# Altium project Ground Station.PrjPcb
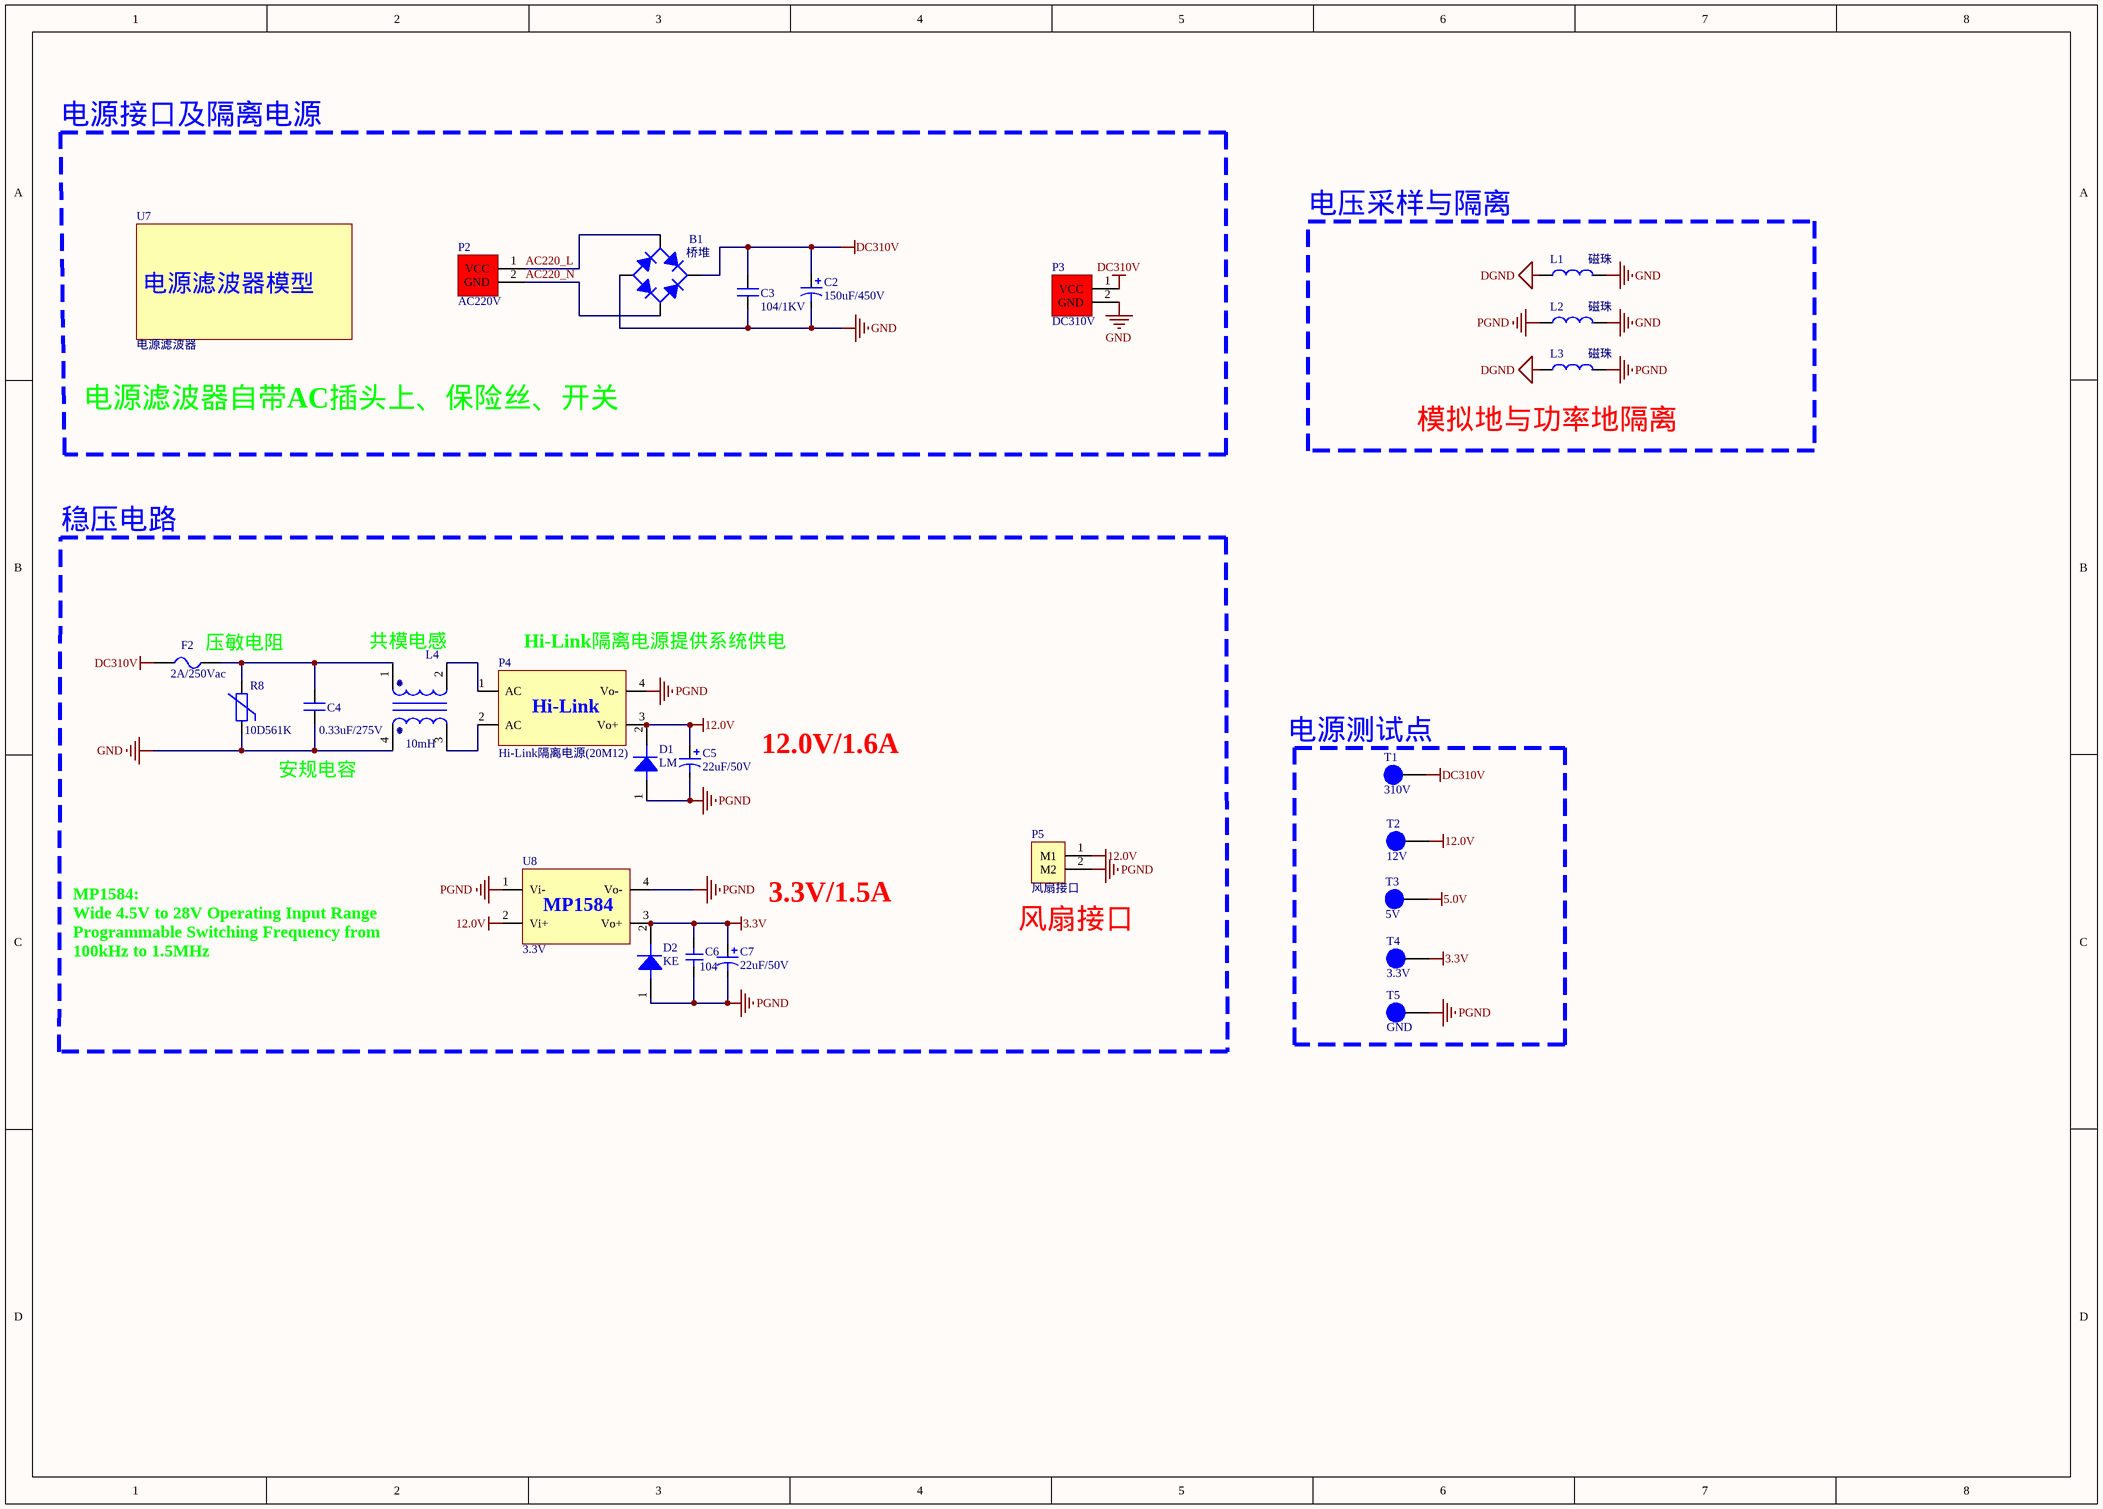
[diagram p0: power.SchDoc]
2 sheets, 50 parts. Net scope: global (net labels, ports and power ports of the same name join across sheets).
Board file: Ground_Station_V1.0.PcbDoc
Sheets:
  power.SchDoc
  device.SchDoc

## Sheet power.SchDoc
size A3

### Parts
B1  桥堆  [KBPC1010]
C2  150uF/450V  [CAP 7.5*18*35.5-H - BK]
C3  104/1KV  [CY 5*7*2.5]
C4  0.33uF/275V  [安规电容 x2v-18w15h5-9t5-p15]
C5  22uF/50V  [CM D(6.3*5.4)]
C6  104  [0805C]
C7  22uF/50V  [CM D(6.3*5.4)]
D1  LM  [SMA]
D2  KE  [SMA]
F2  2A/250Vac  [FU 5x20]
L1  磁珠  [1206L]
L2  磁珠  [1206L]
L3  磁珠  [1206L]
L4  10mH  [T12x6x4]
P2  AC220V  [XT30-F]
P3  DC310V  [XT30-F]
P4  Hi-Link隔离电源(20M12)  [HLK-20M24]
P5  风扇接口  [XH2/2.54mm/180]
R8  10D561K  [VDR 10D-4.5]
T1  310V  [HEADER 1]
T2  12V  [HEADER 1]
T3  5V  [HEADER 1]
T4  3.3V  [HEADER 1]
T5  GND  [HEADER 1]
U7  电源滤波器  [电源滤波器绿灯开关双保险]
U8  3.3V  [MP1584电源模块]

### Nets
3.3V: C6.2 C7.1 D2.2 T4.1 U8.3(Vo+)
5.0V: T3.1
12.0V: C5.1 D1.2 P4.3(Vo+) P5.1(M1) T2.1 U8.2(Vi+)
DC310V: B1.DC+ C2.1 C3.2 F2.1 P3.1(VCC) T1.1
DGND: L1.1 L3.1
GND: B1.DC- C2.2 C3.1 C4.1 L1.2 L2.2 L4.4 P3.2(GND) R8.1
PGND: C5.2 C6.1 C7.2 D1.1 D2.1 L2.1 L3.2 P4.4(Vo-) P5.2(M2) T5.1 U8.1(Vi-) U8.4(Vo-)
AC220_L: B1.AC1 P2.1(VCC)
AC220_N: B1.AC2 P2.2(GND)
NetC4_2: C4.2 F2.2 L4.1 R8.2
NetL4_2: L4.2 P4.1(AC)
NetL4_3: L4.3 P4.2(AC)

### Notes on the sheet
- 电源接口及隔离电源
- 电压采样与隔离
- (near U7) 电源滤波器自带AC插头上、保险丝、开关
- (near L3) 模拟地与功率地隔离
- 稳压电路
- (near F2) 压敏电阻
- (near L4) 共模电感
- (near P4) Hi-Link隔离电源提供系统供电
- 安规电容
- 12.0V/1.6A
- (near T1) 电源测试点
- 3.3V/1.5A
- MP1584:
  Wide 4.5V to 28V Operating Input Range
  Programmable Switching Frequency from
  100kHz to 1.5MHz
- (near P5) 风扇接口
- (in symbol HILINK-24V) Hi-Link
- (in symbol MP1584电源模块) MP1584
- (in symbol 电源滤波器绿灯开关双保险) 电源滤波器模型

### Library data of the parts
C2 C5 C7 = Cap3: 直插极性电容
C3 C4 = Cap2: 无极直插电容
C6 = Cap1: 无极贴片电容
D1 D2 = Diode: 二极管
F2 = Fuse: 保险丝
L1-L3 = L: 电感
L4 = 共模电感
P2 P3 = 电源端子
P4 = HILINK-24V
P5 = 接线端子-2PIN: 2PIN
R8 = 压敏电阻
T1-T5 = 测试点
U7 = 电源滤波器绿灯开关双保险
U8 = MP1584电源模块

## Sheet device.SchDoc
size A3
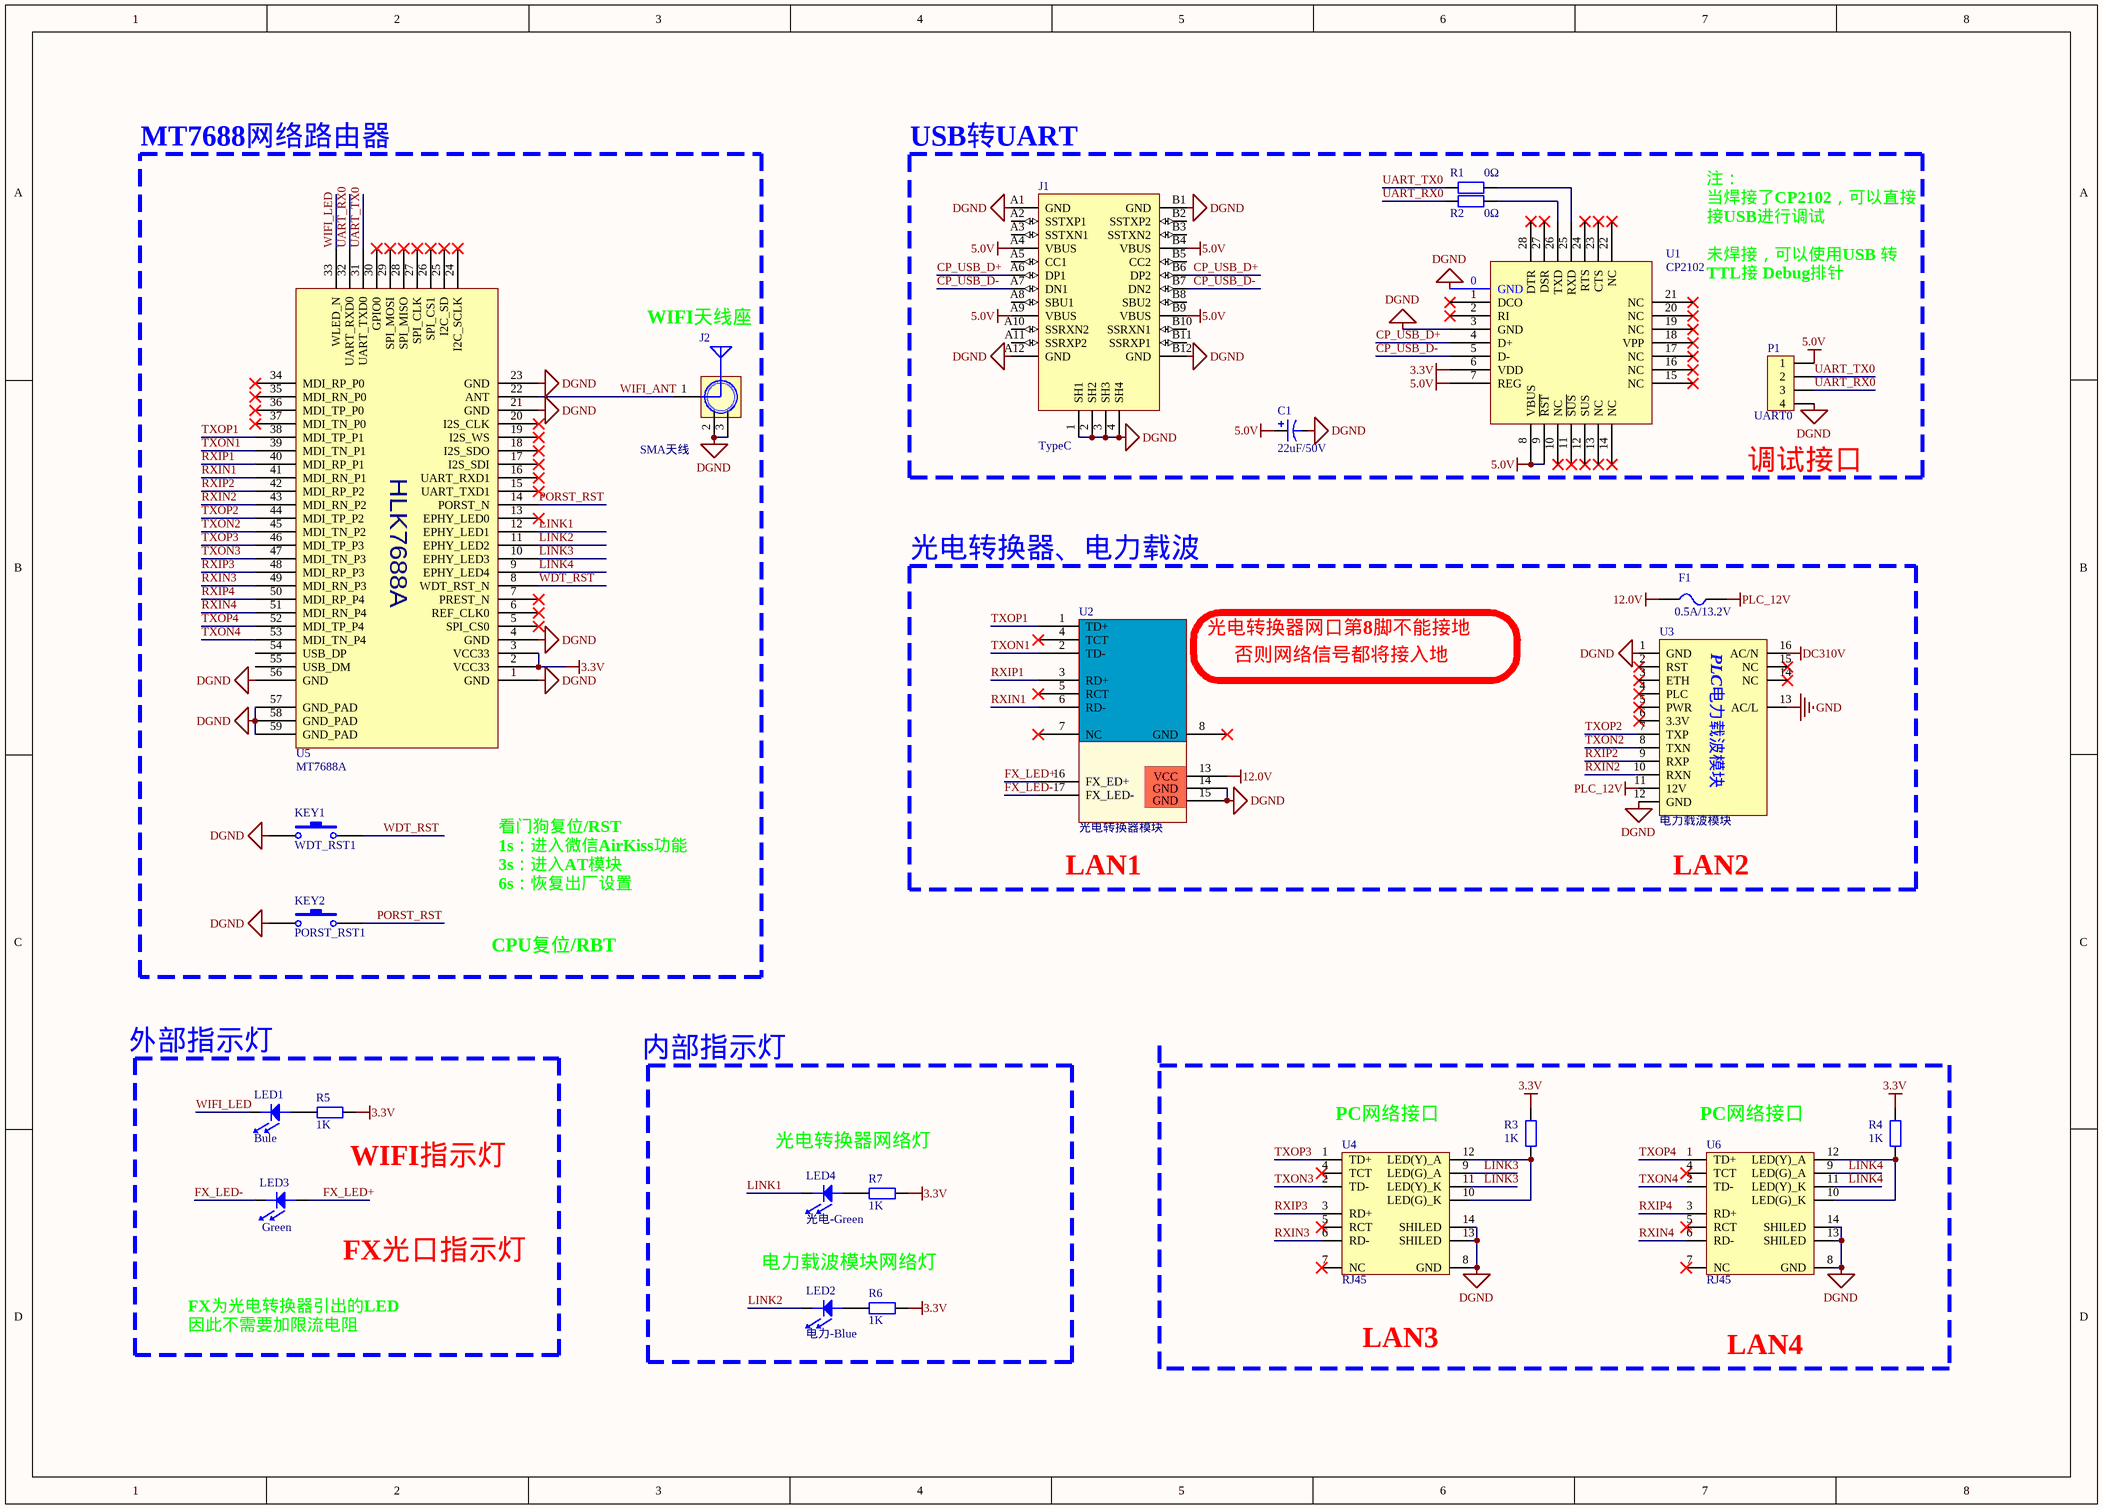
[diagram p1: device.SchDoc]

### Parts
C1  22uF/50V  [CM D(6.3*5.4)]
F1  0.5A/13.2V  [1206F]
J1  TypeC  [TYPE-C 16P]
J2  SMA天线  [SMA_FR]
KEY1  WDT_RST1  [TSW DIP-6*6*8_V]
KEY2  PORST_RST1  [TSW DIP-6*6*8_V]
LED1  Bule  [LED 5mm 弯]
LED2  电力-Blue  [0805LED(GREEN)]
LED3  Green  [LED 5mm 弯]
LED4  光电-Green  [0805LED(GREEN)]
P1  UART0  [Header 4]
R1  0Ω  [0805R]
R2  0Ω  [0805R]
R3  1K  [0805R]
R4  1K  [0805R]
R5  1K  [0805R]
R6  1K  [0805R]
R7  1K  [0805R]
U1  CP2102  [QFN-28]
U2  光电转换器模块  [光电转换器模块]
U3  电力载波模块  [电力载波模块6410（贴片排母）]
U4  RJ45  [RJ45]
U5  MT7688A  [MT7688A]
U6  RJ45  [RJ45]

### Blocks framed on the sheet
MT7688网络路由器: J2 KEY1 KEY2 U5

### Nets
3.3V: R3.1 R4.1 R5.2 R6.2 R7.2 U1.6(VDD) U5.2(VCC33) U5.3(VCC33)
5.0V: C1.1 J1.A4(VBUS) J1.A9(VBUS) J1.B4(VBUS) J1.B9(VBUS) P1.1 U1.7(REG) U1.8(VBUS) U1.9(~{RST})
12.0V: F1.1 U2.13(VCC)
DC310V: U3.16(AC/N)
DGND: C1.2 J1.1(SH1) J1.2(SH2) J1.3(SH3) J1.4(SH4) J1.A1(GND) J1.A12(GND) J1.B1(GND) J1.B12(GND) J2.2(GND) J2.3(GND) KEY1.1 KEY2.1 P1.4 U1.0(GND) U1.3(GND) U2.14(GND) U2.15(GND) U3.1(GND) U3.12(GND) U4.8(GND) U4.13(SHILED) U4.14(SHILED) U5.1(GND) U5.4(GND) U5.21(GND) U5.23(GND) U5.56(GND) U5.57(GND_PAD) U5.58(GND_PAD) U5.59(GND_PAD) U6.8(GND) U6.13(SHILED) U6.14(SHILED)
GND: U3.13(AC/L)
PLC_12V: F1.2 U3.11(12V)
CP_USB_D+: J1.A6(DP1) J1.B6(DP2) U1.4(D+)
CP_USB_D-: J1.A7(DN1) J1.B7(DN2) U1.5(D-)
FX_LED+: LED3.1 U2.16(FX_ED+)
FX_LED-: LED3.2 U2.17(FX_LED-)
LINK1: LED4.2 U5.12(EPHY_LED1)
LINK2: LED2.2 U5.11(EPHY_LED2)
LINK3: U4.9(LED(G)_A) U4.11(LED(Y)_K) U5.10(EPHY_LED3)
LINK4: U5.9(EPHY_LED4) U6.9(LED(G)_A) U6.11(LED(Y)_K)
PORST_RST: KEY2.2 U5.14(PORST_N)
RXIN1: U2.6(RD-) U5.41(MDI_RN_P1)
RXIN2: U3.10(RXN) U5.43(MDI_RN_P2)
RXIN3: U4.6(RD-) U5.49(MDI_RN_P3)
RXIN4: U5.51(MDI_RN_P4) U6.6(RD-)
RXIP1: U2.3(RD+) U5.40(MDI_RP_P1)
RXIP2: U3.9(RXP) U5.42(MDI_RP_P2)
RXIP3: U4.3(RD+) U5.48(MDI_RP_P3)
RXIP4: U5.50(MDI_RP_P4) U6.3(RD+)
TXON1: U2.2(TD-) U5.39(MDI_TN_P1)
TXON2: U3.8(TXN) U5.45(MDI_TN_P2)
TXON3: U4.2(TD-) U5.47(MDI_TN_P3)
TXON4: U5.53(MDI_TN_P4) U6.2(TD-)
TXOP1: U2.1(TD+) U5.38(MDI_TP_P1)
TXOP2: U3.7(TXP) U5.44(MDI_TP_P2)
TXOP3: U4.1(TD+) U5.46(MDI_TP_P3)
TXOP4: U5.52(MDI_TP_P4) U6.1(TD+)
UART_RX0: P1.3 R2.2 U5.32(UART_RXD0)
UART_TX0: P1.2 R1.2 U5.31(UART_TXD0)
WDT_RST: KEY1.2 U5.8(WDT_RST_N)
WIFI_ANT: J2.1(ANT) U5.22(ANT)
WIFI_LED: LED1.2 U5.33(WLED_N)
NetLED1_1: LED1.1 R5.1
NetLED2_1: LED2.1 R6.1
NetLED4_1: LED4.1 R7.1
NetR1_1: R1.1 U1.25(RXD)
NetR2_1: R2.1 U1.26(TXD)
NetR3_2: R3.2 U4.10(LED(G)_K) U4.12(LED(Y)_A)
NetR4_2: R4.2 U6.10(LED(G)_K) U6.12(LED(Y)_A)

Not connected (* = marked no-connect by the designer): J1 A2(SSTXP1) A3(SSTXN1) A5(CC1) A8(SBU1) A10(SSRXN2) A11(SSRXP2) B2(SSTXP2) B3(SSTXN2) B5(CC2) B8(SBU2) B10(SSRXN1) B11(SSRXP1); U1 1(DCO)* 2(RI)* 10(NC)* 11(~{SUS})* 12(SUS)* 13(NC)* 14(NC)* 15(NC)* 16(NC)* 17(NC)* 18(VPP)* 19(NC)* 20(NC)* 21(NC)* 22(NC)* 23(CTS)* 24(RTS)* 27(DSR)* 28(DTR)*; U2 4(TCT)* 5(RCT)* 7(NC)* 8(GND)*; U3 2(RST)* 3(ETH)* 4(PLC)* 5(PWR)* 6(3.3V)* 14(NC)* 15(NC)*; U4 4(TCT)* 5(RCT)* 7(NC)*; U5 5(SPI_CS0)* 6(REF_CLK0)* 7(PREST_N)* 13(EPHY_LED0)* 15(UART_TXD1)* 16(UART_RXD1)* 17(I2S_SDI)* 18(I2S_SDO)* 19(I2S_WS)* 20(I2S_CLK)* 24(I2C_SCLK)* 25(I2C_SD)* 26(SPI_CS1)* 27(SPI_CLK)* 28(SPI_MISO)* 29(SPI_MOSI)* 30(GPIO0)* 34(MDI_RP_P0)* 35(MDI_RN_P0)* 36(MDI_TP_P0)* 37(MDI_TN_P0)* 54(USB_DP) 55(USB_DM); U6 4(TCT)* 5(RCT)* 7(NC)*

### Notes on the sheet
- USB转UART
- 注：
  当焊接了CP2102，可以直接接USB进行调试
  未焊接，可以使用USB 转TTL接 Debug排针
- WIFI天线座
- (near P1) 调试接口
- 光电转换器、电力载波
- (near U2) 光电转换器网口第8脚不能接地
- (near U2) 否则网络信号都将接入地
- 看门狗复位/RST
  1s：进入微信AirKiss功能
  3s：进入AT模块
  6s：恢复出厂设置
- (near U2) LAN1
- (near U3) LAN2
- CPU复位/RBT
- 外部指示灯
- 内部指示灯
- (near U4) PC网络接口
- (near U6) PC网络接口
- (near R5) WIFI指示灯
- 光电转换器网络灯
- FX光口指示灯
- 电力载波模块网络灯
- FX为光电转换器引出的LED
  因此不需要加限流电阻
- LAN3
- LAN4
- (in symbol MT7688A) HLK7688A
- (in symbol 电力载波模块6410) PLC电力载波模块

### Library data of the parts
C1 = Cap3: 直插极性电容
F1 = Fuse: 保险丝
J2 = SMA-KE
KEY1 KEY2 = 轻触按键: 轻触开关
LED1-LED4 = LED: 发光二极管
P1 = Header 4: 排针
R1-R7 = Res: 电阻
U1 = CP2102: USB转串口芯片
U3 = 电力载波模块6410
U5 = MT7688A: MT7688A模组

## Nets that join several sheets
3.3V: power (5 pins), device (8 pins)
5.0V: power (T3.1), device (9 pins)
12.0V: power (6 pins), device (F1.1 U2.13)
DC310V: power (6 pins), device (U3.16)
DGND: power (L1.1 L3.1), device (34 pins)
GND: power (9 pins), device (U3.13)